# Altium schematic sheet mboard_battery.SchDoc: =GlobalProjectName
size 209 x 297 mm; SheetNumber: Лист; SheetTotal: Листов; PageSetup: Record=PageOptions|CenterHorizontal=True|CenterVertical=True|PrintScale=1.00|XCorrection=1.00|YCorrection=1.00|PrintKind=1|BorderSize=5000000|LeftOffset=0|BottomOffset=0|Orientation=2|PaperLength=1000|PaperWidth=1000|Scale=100|PaperSource=15|PrintQuality=1200|MediaType=1|DitherType=10|PaperKind=A3|PrintScaleMode=1; Weight: -; ScaleFactor: -
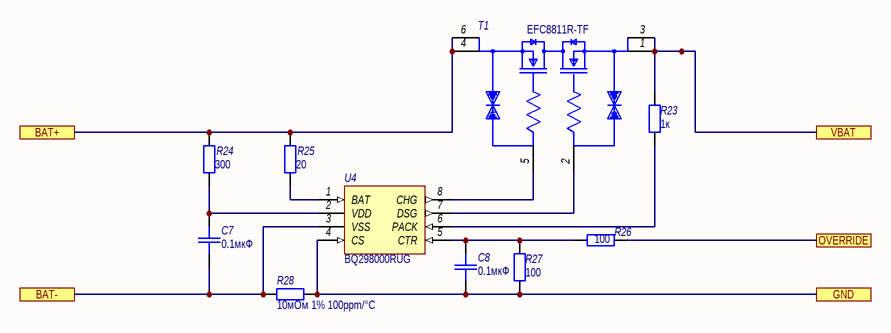
[diagram p0: mboard_battery.SchDoc]

## Parts
C7  0.1мкФ  [SMD_C0603]
C8  0.1мкФ  [SMD_C0603]
R23  1к  [SMD_0603]
R24  300  [SMD_0603]
R25  20  [SMD_0603]
R26  100  [SMD_0603]
R27  100  [SMD_0603]
R28  10мОм 1% 100ppm/°C  [SMD_0805]
T1  EFC8811R-TF  [FP-568AL-MFG]
U4  BQ298000RUG  [X2QFN-8]

## Ports
BAT+, BAT-, GND, OVERRIDE, VBAT

## Nets
BAT+: R24.2 R25.2 T1.4(SOURCE2) T1.6(SOURCE2) ; port BAT+
BAT-: C7.2 R28.1 U4.3(VSS) ; port BAT-
GND: C8.2 R27.2 R28.2 U4.4(CS) ; port GND
OVERRIDE: R26.1 ; port OVERRIDE
VBAT: R23.1 T1.1(SOURCE1) T1.3(SOURCE1) ; port VBAT
NetC7_1: C7.1 R24.1 U4.2(VDD)
NetC8_1: C8.1 R26.2 R27.1 U4.5(CTR)
NetR23_2: R23.2 U4.6(PACK)
NetR25_1: R25.1 U4.1(BAT)
NetT1_2: T1.2(GATE1) U4.7(DSG)
NetT1_5: T1.5(GATE2) U4.8(CHG)

## Notes on the sheet
- Подп. и дата
- Инв. № дубл.
- Взам. инв. №
- Инв. № подл.
- Изм.
- Лист
- № докум.
- Подп.
- Дата
- Форма 2а ГОСТ 2.104-2006
- Копировал
- Формат А4

## Library data of the parts
C7 C8 = Capacitor: Назначение: SMD-конденсатор; Наименование: Конденсатор; Потребление, Вт: 0; Value: 0.1мкФ
R23-R27 = Resistor: Наименование: Резистор; Назначение: SMD-резистор; Потребление, Вт: 0,001
  R23: Value: 1к
  R24: Value: 300
  R25: Value: 20
  R26 R27: Value: 100
R28 = Resistor: PE1206DRM470R01L; Наименование: Резистор; Назначение: SMD-резистор; Потребление, Вт: 0,001; Value: 10мОм 1% 100ppm/°C
T1 = EFC8811R-TF: Dual N-Channel power MOSFET; Потребление, Вт: 0.001; Назначение: Dual N-Channel power MOSFET; ComponentLink1Description: DataSheet; ComponentLink1URL: https://www.farnell.com/datasheets/2197419.pdf; Наименование: EFC8811R-TF
U4 = BQ2980xy: Voltage, Current, Temperature Protectors with an Integrated High-Side / NFET Driver for Fast/Flash Charging Single-Cell Li-Ion and Li-Polymer Batteries; Потребление, Вт: 0.001; Наименование: BQ298000RUG; Назначение: Voltage, Current, Temperature Protectors with an Integrated High-Side; ComponentLink1Description: DataSheet; ComponentLink1URL: https://www.ti.com/lit/ds/symlink/bq2980.pdf?ts=1635593723857&ref_url=https%253A%252F%252Fwww.ti.com%252Fproduct%252FBQ2980